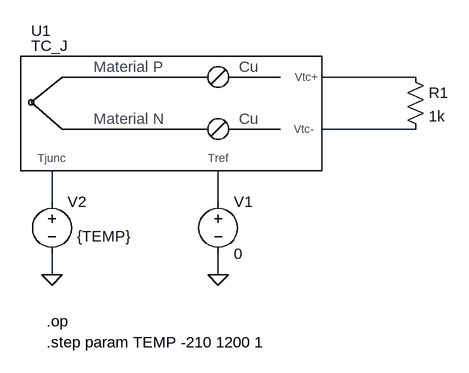
[diagram p0: schematic J_Type.asc]
J_Type.asc, the LTspice schematic file:
Version 4.1
SHEET 1 880 680
WIRE 608 -112 464 -112
WIRE 608 -32 464 -32
WIRE 48 80 48 32
WIRE 304 80 304 32
WIRE 48 192 48 160
WIRE 304 192 304 160
FLAG 304 192 0
FLAG 48 192 0
SYMBOL voltage 304 64 R0
WINDOW 123 0 0 Left 0
WINDOW 39 0 0 Left 0
SYMATTR InstName V1
SYMATTR Value 0
SYMBOL voltage 48 64 R0
WINDOW 123 0 0 Left 0
WINDOW 39 0 0 Left 0
WINDOW 3 39 69 Left 2
SYMATTR Value {TEMP}
SYMATTR InstName V2
SYMBOL res 592 -128 R0
SYMATTR InstName R1
SYMATTR Value 1k
SYMBOL MyLib\\Sensor_TC\\J_Type 320 -96 R0
SYMATTR InstName U1
TEXT 40 296 Left 2 !.step param TEMP -210 1200 1
TEXT 40 264 Left 2 !.op

The netlist it stands for:
* J_Type.asc
V1 N004 0 0
V2 N003 0 {TEMP}
R1 N001 N002 1k
X§U1 N003 N004 N001 N002 TC_J  ; pins Tjunc Tref Vtc+ Vtc-
.step param TEMP -210 1200 1
.op
.lib MyLib/Sensor_TC/J_Type.lib
.backanno
.end